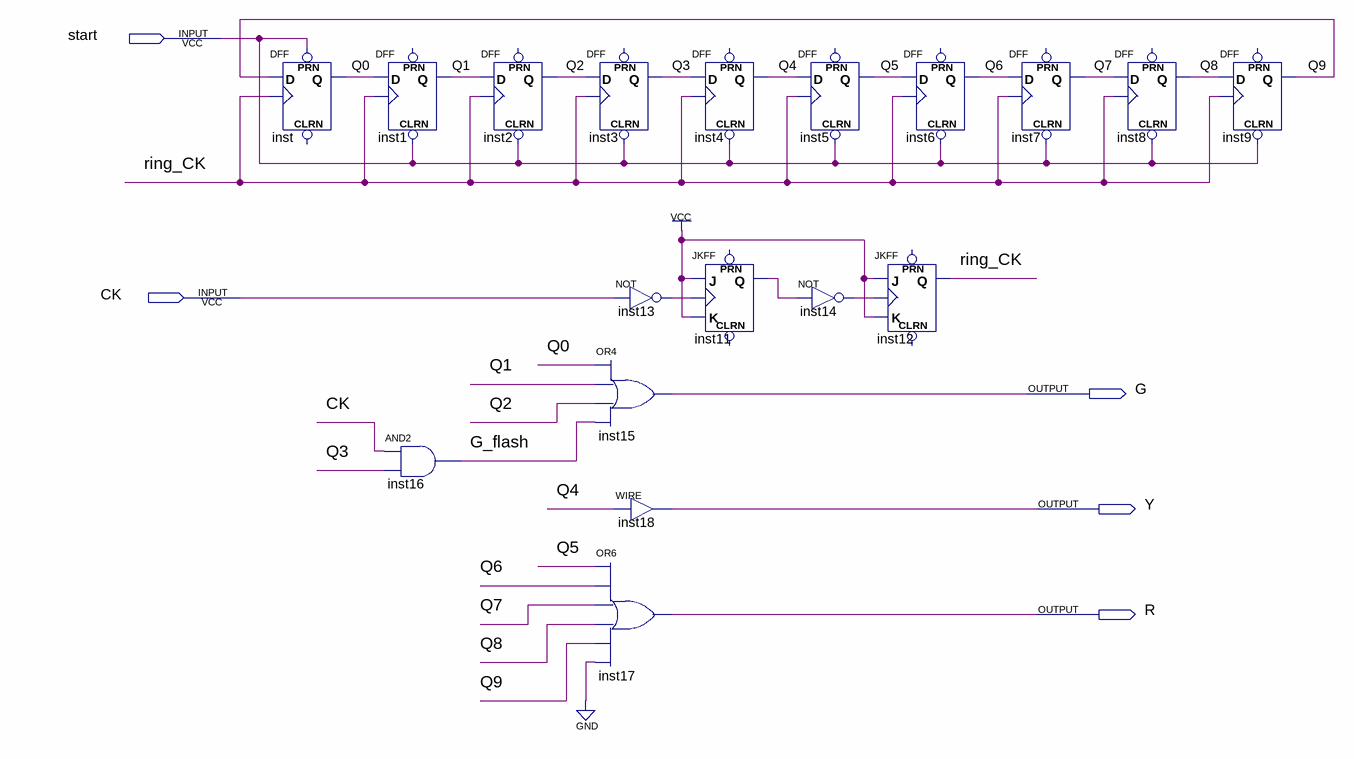
[diagram p0: schematic sheet]
// Quartus schematic Traffic_lights.bdf as structural Verilog: 18 symbols, 5 pins
module Traffic_lights (
  input  start,
  input  CK,
  output G,
  output Y,
  output R
);

  wire G_flash, inst11_q, inst13_out, inst14_out, Q0, Q1, Q2, Q3, Q4, Q5, Q6, Q7, Q8, Q9, ring_CK;

  DFF inst (.CLK(ring_CK), .D(Q9), .PRN(start), .Q(Q0));  // open: CLRN
  DFF inst1 (.CLRN(start), .CLK(ring_CK), .D(Q0), .Q(Q1));  // open: PRN
  and inst16 (G_flash, CK, Q3);
  DFF inst2 (.CLRN(start), .CLK(ring_CK), .D(Q1), .Q(Q2));  // open: PRN
  DFF inst3 (.CLRN(start), .CLK(ring_CK), .D(Q2), .Q(Q3));  // open: PRN
  not inst13 (inst13_out, CK);
  or inst15 (G, Q0, Q1, Q2, G_flash);
  assign Y = Q4;  // WIRE inst18
  or inst17 (R, Q5, Q6, Q7, Q8, Q9, 1'b0);
  DFF inst4 (.CLRN(start), .CLK(ring_CK), .D(Q3), .Q(Q4));  // open: PRN
  JKFF inst11 (.K(1'b1), .J(1'b1), .CLK(inst13_out), .Q(inst11_q));  // open: PRN, CLRN
  DFF inst5 (.CLRN(start), .CLK(ring_CK), .D(Q4), .Q(Q5));  // open: PRN
  not inst14 (inst14_out, inst11_q);
  JKFF inst12 (.K(1'b1), .J(1'b1), .CLK(inst14_out), .Q(ring_CK));  // open: PRN, CLRN
  DFF inst6 (.CLRN(start), .CLK(ring_CK), .D(Q5), .Q(Q6));  // open: PRN
  DFF inst7 (.CLRN(start), .CLK(ring_CK), .D(Q6), .Q(Q7));  // open: PRN
  DFF inst8 (.CLRN(start), .CLK(ring_CK), .D(Q7), .Q(Q8));  // open: PRN
  DFF inst9 (.CLRN(start), .CLK(ring_CK), .D(Q8), .Q(Q9));  // open: PRN
endmodule
